# Altium schematic sheet Slave.SchDoc
size A
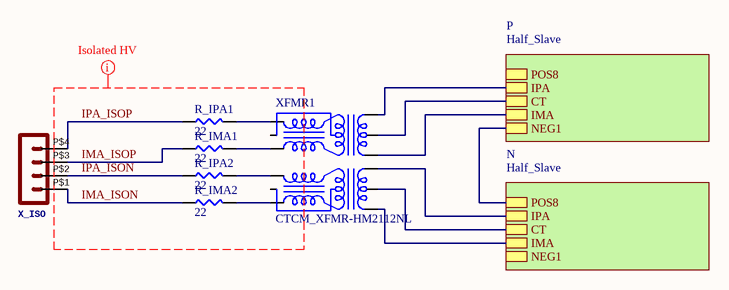
[diagram p0: Slave.SchDoc]

## Parts
R_IMA1  22  [RES-0603]
R_IMA2  22  [RES-0603]
R_IPA1  22  [RES-0603]
R_IPA2  22  [RES-0603]
X_ISO  Molex - Micro-Fit 3.0 Series connector,  3.00mm (0.118") pitch header, 4 positions.  [43650-0424]  (value not drawn)
XFMR1  CTCM_XFMR-HM2112NL  [HM2112NL]

## Sub-sheets
N = Half_Slave: POS8, IMA, IPA, NEG1, CT
P = Half_Slave: POS8, IMA, NEG1, CT, IPA

## Nets
IMA_ISON: R_IMA2.1 X_ISO.P$1
IMA_ISOP: R_IMA1.1 X_ISO.P$3
IPA_ISON: R_IPA2.1 X_ISO.P$2
IPA_ISOP: R_IPA1.1 X_ISO.P$4
NetR_IMA1_2: R_IMA1.2 XFMR1.9
NetR_IMA2_2: R_IMA2.2 XFMR1.12
NetR_IPA1_2: R_IPA1.2 XFMR1.7
NetR_IPA2_2: R_IPA2.2 XFMR1.10
NetXFMR1_1: XFMR1.1 ; sheet N/IMA
NetXFMR1_2: XFMR1.2 ; sheet N/CT
NetXFMR1_3: XFMR1.3 ; sheet N/IPA
NetXFMR1_4: XFMR1.4 ; sheet P/IMA
NetXFMR1_5: XFMR1.5 ; sheet P/CT
NetXFMR1_6: XFMR1.6 ; sheet P/IPA
(unnamed): sheet P/NEG1, sheet N/POS8

Not connected (* = marked no-connect by the designer): XFMR1 8 11

## Layout directives
net class ISO: IMA_ISON, IMA_ISOP, IPA_ISON, IPA_ISOP

## Library data of the parts
R_IMA1 R_IMA2 R_IPA1 R_IPA2 = RES-0603
X_ISO = POS4_MF43650-0424: GateName_1: G$1; SymbolName_1: HEADER_POS4; DeviceSetName: HEADER_POS4_?; DeviceName: 43650-0424; LibraryName: MOLEX Micro-Fit; Package: 43650-0424